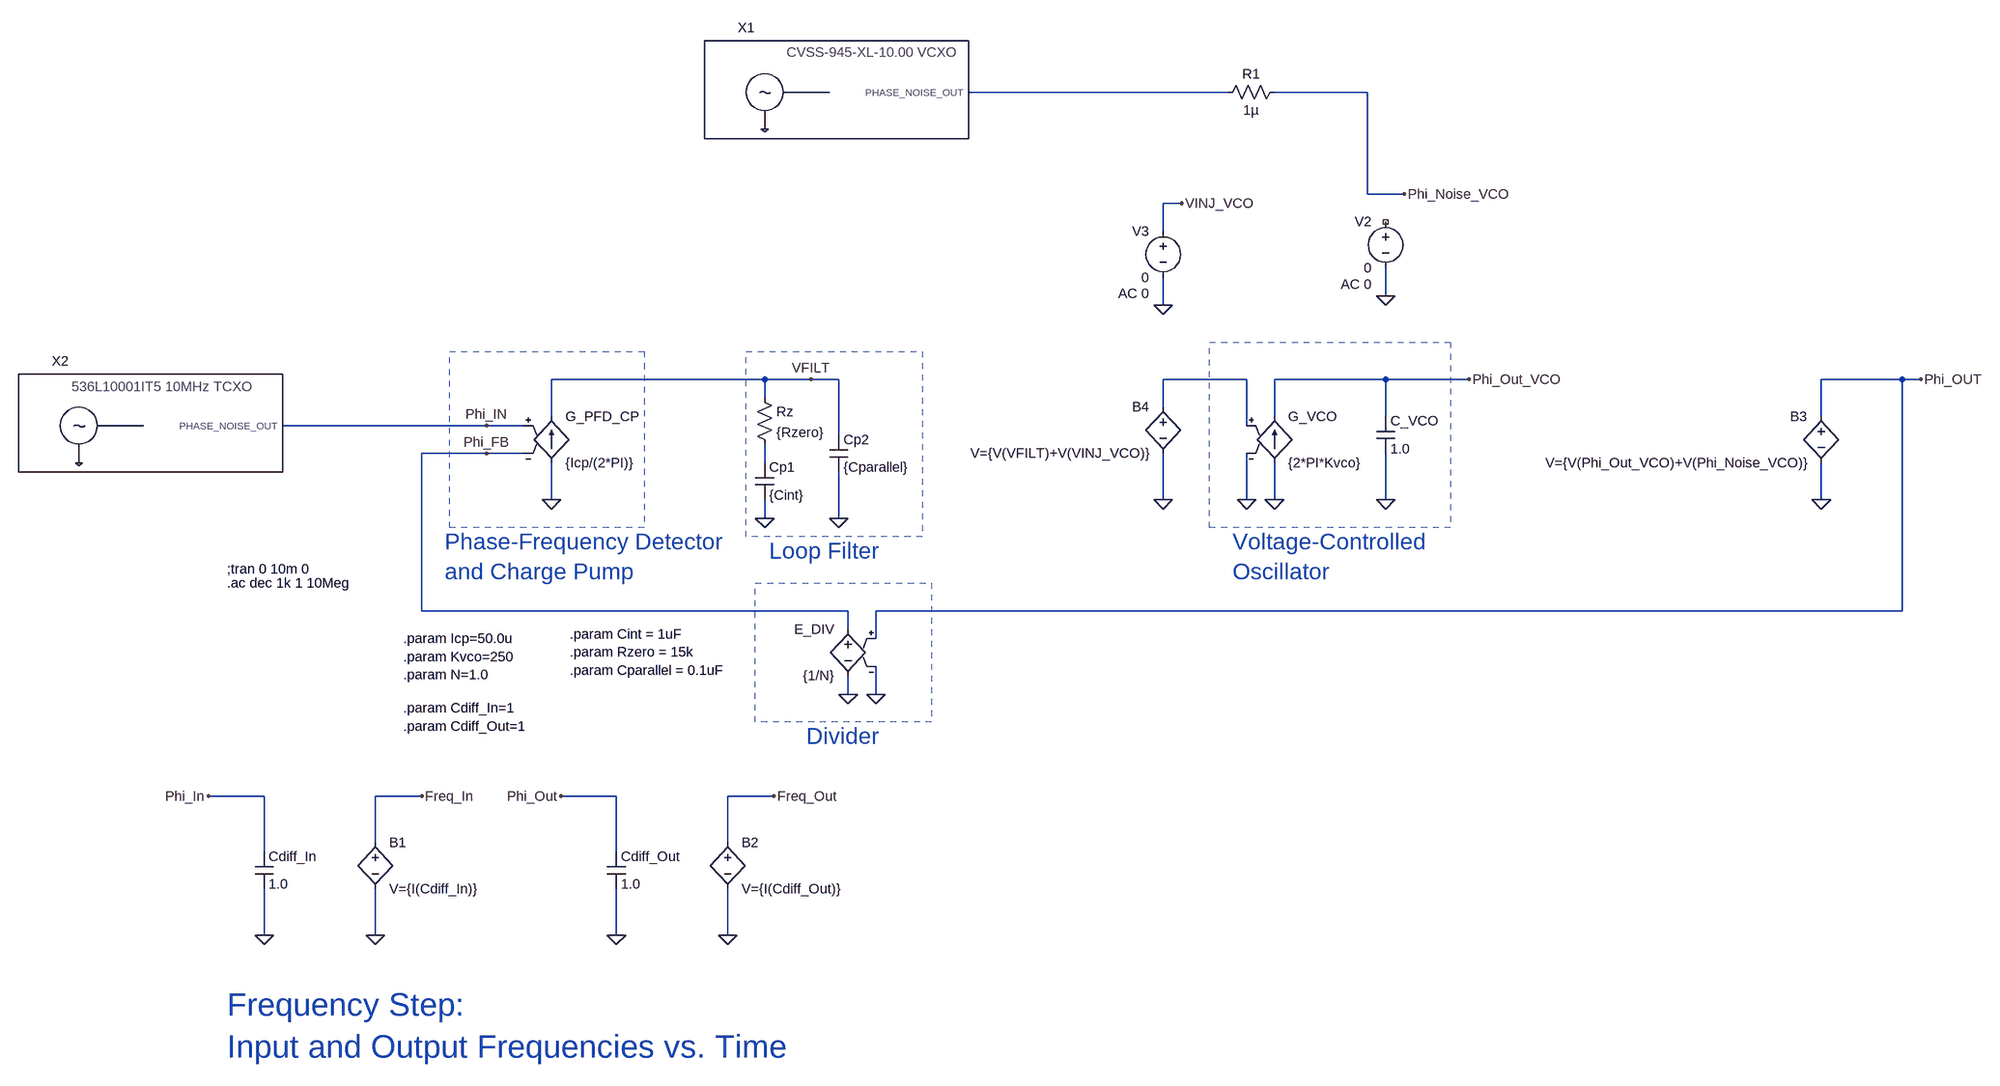
[diagram p0: schematic HMC1031_10MHz_PLL.asc]
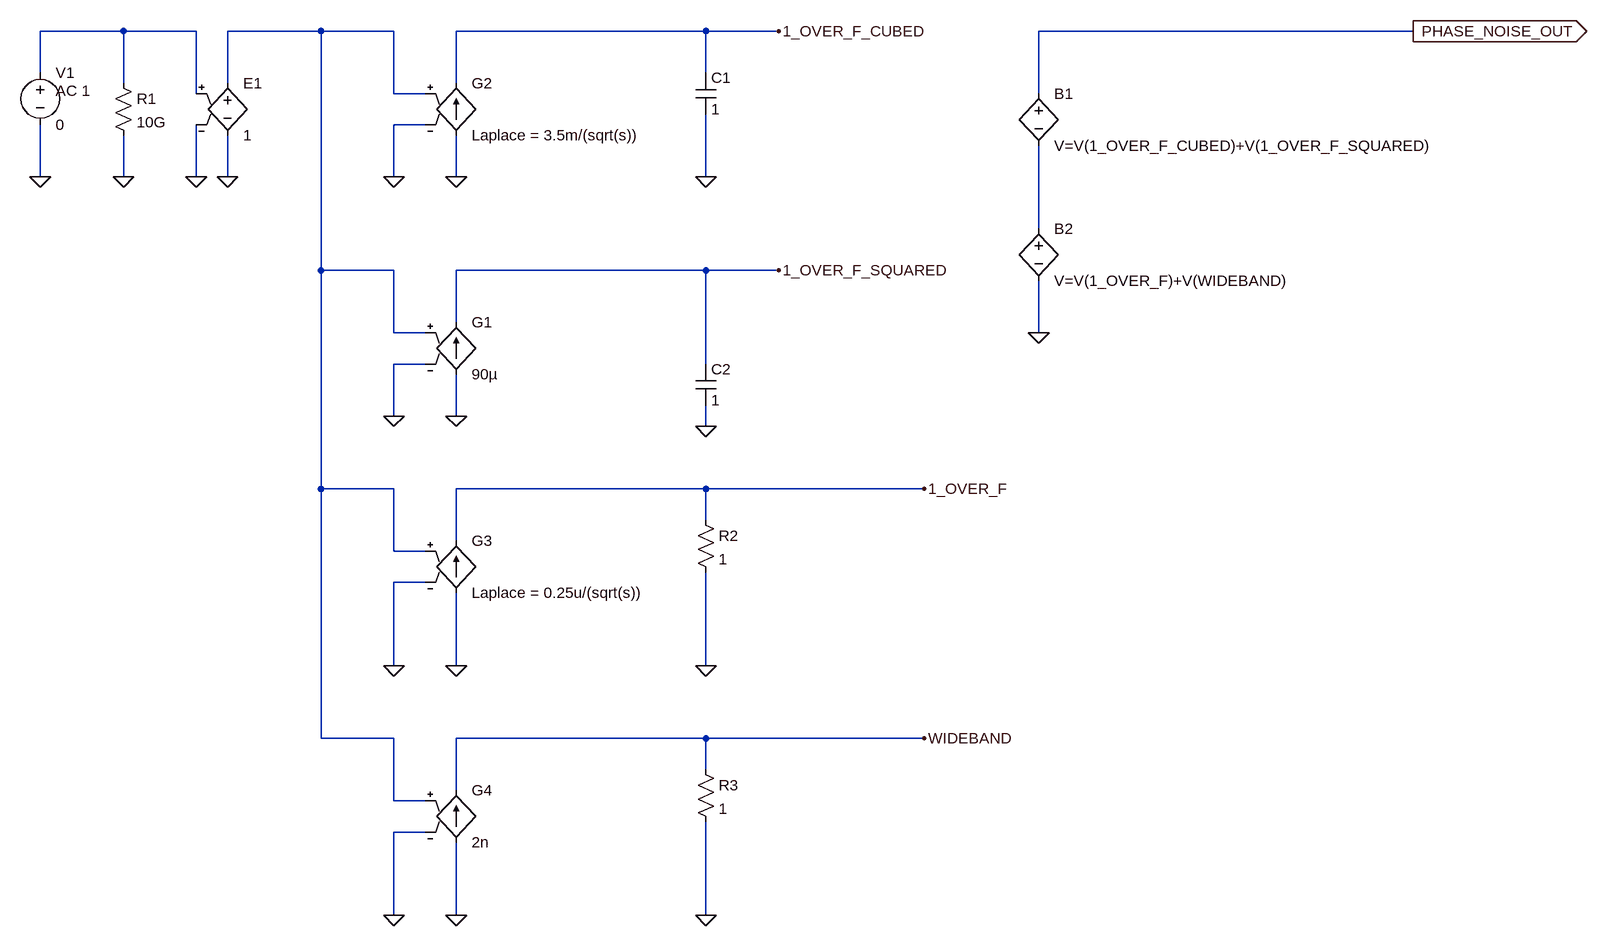
[diagram p1: sub-circuit cvss_945_xl_10_phase_noise_model.asc]
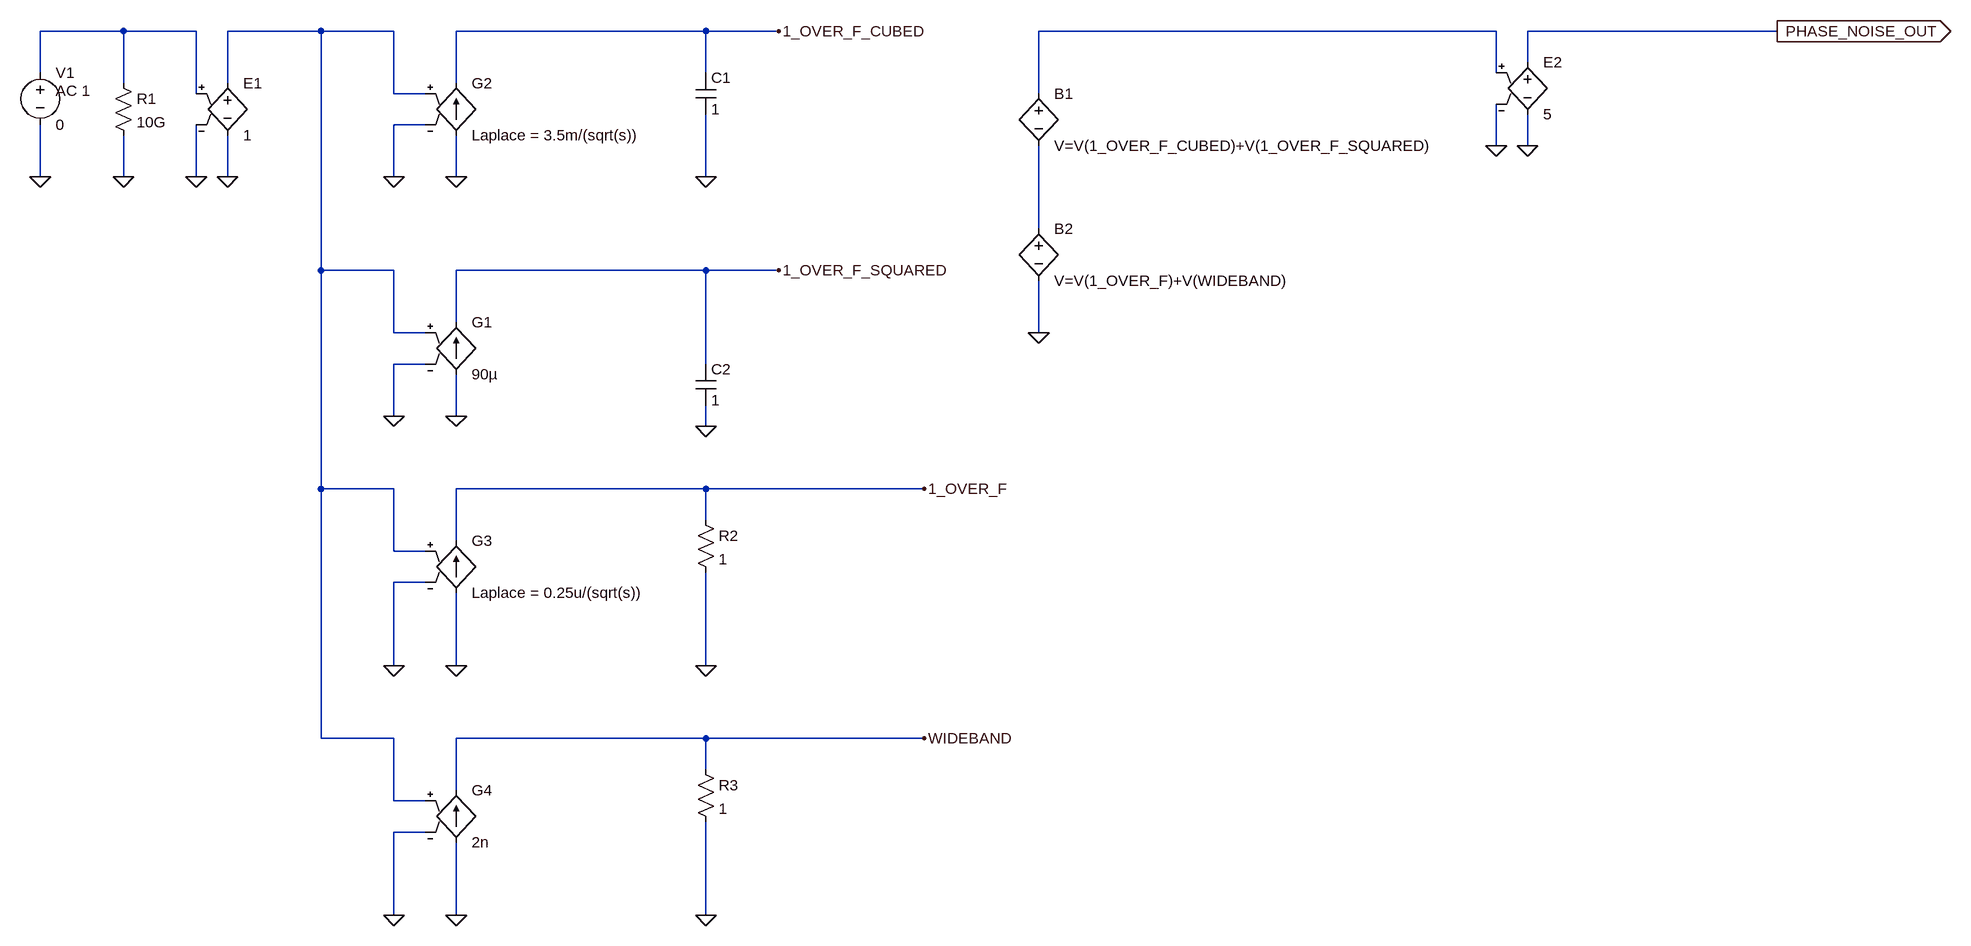
[diagram p2: sub-circuit 536l10001it5_phase_noise_model.asc]
HMC1031_10MHz_PLL.asc, the LTspice schematic file:
Version 4
SHEET 1 1592 1876
WIRE -320 -368 -768 -368
WIRE -80 -368 -240 -368
WIRE -80 -192 -80 -368
WIRE -16 -192 -80 -192
WIRE -400 -176 -432 -176
WIRE -432 -128 -432 -176
WIRE -48 -16 -48 -64
WIRE -432 0 -432 -48
WIRE -1120 128 -1488 128
WIRE -1040 128 -1120 128
WIRE -992 128 -1040 128
WIRE -288 128 -432 128
WIRE -48 128 -240 128
WIRE 96 128 -48 128
WIRE 864 128 704 128
WIRE 896 128 864 128
WIRE -1120 160 -1120 128
WIRE -432 176 -432 128
WIRE -1488 192 -1488 128
WIRE -240 192 -240 128
WIRE -48 192 -48 128
WIRE 704 192 704 128
WIRE -1600 208 -1952 208
WIRE -1536 208 -1600 208
WIRE -288 208 -288 128
WIRE -992 224 -992 128
WIRE -1600 256 -1712 256
WIRE -1536 256 -1600 256
WIRE -1120 272 -1120 240
WIRE -1488 336 -1488 272
WIRE -432 336 -432 256
WIRE -288 336 -288 256
WIRE -240 336 -240 272
WIRE -48 336 -48 256
WIRE 704 336 704 272
WIRE -1120 368 -1120 336
WIRE -992 368 -992 288
WIRE -1712 528 -1712 256
WIRE -976 528 -1712 528
WIRE 864 528 864 128
WIRE 864 528 -928 528
WIRE -976 560 -976 528
WIRE -928 576 -928 528
WIRE -976 672 -976 640
WIRE -928 672 -928 624
WIRE -1984 848 -2080 848
WIRE -1712 848 -1792 848
WIRE -1376 848 -1472 848
WIRE -1104 848 -1184 848
WIRE -1792 928 -1792 848
WIRE -1184 928 -1184 848
WIRE -1984 944 -1984 848
WIRE -1376 944 -1376 848
WIRE -1984 1088 -1984 1008
WIRE -1792 1088 -1792 1008
WIRE -1376 1088 -1376 1008
WIRE -1184 1088 -1184 1008
FLAG -992 368 0
FLAG -1488 336 0
FLAG -48 336 0
FLAG -240 336 0
FLAG -288 336 0
FLAG 896 128 Phi_OUT
FLAG -928 672 0
FLAG -976 672 0
FLAG -1600 256 Phi_FB
FLAG -1600 208 Phi_IN
FLAG -1120 368 0
FLAG -1040 128 VFILT
FLAG -1984 1088 0
FLAG -2080 848 Phi_In
FLAG -1792 1088 0
FLAG -1712 848 Freq_In
FLAG -1376 1088 0
FLAG -1472 848 Phi_Out
FLAG -1184 1088 0
FLAG -1104 848 Freq_Out
FLAG 96 128 Phi_Out_VCO
FLAG -48 -16 0
FLAG -16 -192 Phi_Noise_VCO
FLAG 704 336 0
FLAG -432 336 0
FLAG -432 0 0
FLAG -400 -176 VINJ_VCO
SYMBOL g -1488 176 R0
SYMATTR InstName G_PFD_CP
SYMATTR Value {Icp/(2*PI)}
SYMBOL cap -1008 224 R0
SYMATTR InstName Cp2
SYMATTR Value {Cparallel}
SYMBOL cap -64 192 R0
SYMATTR InstName C_VCO
SYMATTR Value 1.0
SYMBOL g -240 176 R0
SYMATTR InstName G_VCO
SYMATTR Value {2*PI*Kvco}
SYMBOL e -976 544 M0
SYMATTR InstName E_DIV
SYMATTR Value {1/N}
SYMBOL cap -1136 272 R0
SYMATTR InstName Cp1
SYMATTR Value {Cint}
SYMBOL res -1136 144 R0
SYMATTR InstName Rz
SYMATTR Value {Rzero}
SYMBOL cap -2000 944 R0
SYMATTR InstName Cdiff_In
SYMATTR Value 1.0
SYMBOL bv -1792 912 R0
SYMATTR InstName B1
SYMATTR Value V={I(Cdiff_In)}
SYMBOL cap -1392 944 R0
SYMATTR InstName Cdiff_Out
SYMATTR Value 1.0
SYMBOL bv -1184 912 R0
SYMATTR InstName B2
SYMATTR Value V={I(Cdiff_Out)}
SYMBOL voltage -48 -160 M0
WINDOW 123 24 124 Left 2
WINDOW 39 0 0 Left 2
SYMATTR Value2 AC 0
SYMATTR InstName V2
SYMATTR Value 0
SYMBOL bv 704 176 M0
SYMATTR InstName B3
SYMATTR Value V={V(Phi_Out_VCO)+V(Phi_Noise_VCO)}
SYMBOL bv -432 160 M0
SYMATTR InstName B4
SYMATTR Value V={V(VFILT)+V(VINJ_VCO)}
SYMBOL voltage -432 -144 M0
WINDOW 123 24 124 Left 2
WINDOW 39 0 0 Left 2
SYMATTR Value2 AC 0
SYMATTR InstName V3
SYMATTR Value 0
SYMBOL CVSS_945_XL_10_Phase_Noise_Model -1120 -368 R0
SYMATTR InstName X1
SYMBOL 536L10001IT5_Phase_Noise_Model -2304 208 R0
SYMATTR InstName X2
SYMBOL res -224 -384 R90
WINDOW 0 0 56 VBottom 2
WINDOW 3 32 56 VTop 2
SYMATTR InstName R1
SYMATTR Value 1µ
TEXT -1744 576 Left 2 !.param Icp=50.0u\n.param Kvco=250\n.param N=1.0
TEXT -2048 480 Left 2 !.ac dec 1k 1 10Meg
TEXT -2048 456 Left 2 !;tran 0 10m 0
TEXT -2048 1208 Left 5 ;Frequency Step:\nInput and Output Frequencies vs. Time
TEXT -1112 424 Left 4 ;Loop Filter
TEXT -1672 408 Left 4 ;Phase-Frequency Detector\nand Charge Pump
TEXT -312 408 Left 4 ;Voltage-Controlled\nOscillator
TEXT -1048 744 Left 4 ;Divider
TEXT -1456 568 Left 2 !.param Cint = 1uF\n.param Rzero = 15k\n.param Cparallel = 0.1uF
TEXT -1744 696 Left 2 !.param Cdiff_In=1\n.param Cdiff_Out=1
RECTANGLE Normal -1328 384 -1664 80 2
RECTANGLE Normal -848 400 -1152 80 2
RECTANGLE Normal 64 384 -352 64 2
RECTANGLE Normal -832 720 -1136 480 2

cvss_945_xl_10_phase_noise_model.asc, the sub-circuit schematic file:
Version 4
SHEET 1 1556 916
WIRE -720 -464 -848 -464
WIRE -608 -464 -720 -464
WIRE -416 -464 -560 -464
WIRE -304 -464 -416 -464
WIRE 176 -464 -208 -464
WIRE 288 -464 176 -464
WIRE 1264 -464 688 -464
WIRE -848 -400 -848 -464
WIRE 176 -400 176 -464
WIRE -720 -384 -720 -464
WIRE -560 -384 -560 -464
WIRE -208 -384 -208 -464
WIRE -608 -368 -608 -464
WIRE -304 -368 -304 -464
WIRE -256 -368 -304 -368
WIRE 688 -368 688 -464
WIRE -256 -320 -304 -320
WIRE -848 -240 -848 -320
WIRE -720 -240 -720 -304
WIRE -608 -240 -608 -320
WIRE -560 -240 -560 -304
WIRE -304 -240 -304 -320
WIRE -208 -240 -208 -304
WIRE 176 -240 176 -336
WIRE 688 -160 688 -288
WIRE -416 -96 -416 -464
WIRE -304 -96 -416 -96
WIRE 176 -96 -208 -96
WIRE 288 -96 176 -96
WIRE -208 -16 -208 -96
WIRE -304 0 -304 -96
WIRE -256 0 -304 0
WIRE 688 0 688 -80
WIRE -256 48 -304 48
WIRE 176 48 176 -96
WIRE -304 128 -304 48
WIRE -208 128 -208 64
WIRE 176 144 176 112
WIRE -416 240 -416 -96
WIRE -304 240 -416 240
WIRE 176 240 -208 240
WIRE 512 240 176 240
WIRE 176 288 176 240
WIRE -208 320 -208 240
WIRE -304 336 -304 240
WIRE -256 336 -304 336
WIRE -256 384 -304 384
WIRE -304 512 -304 384
WIRE -208 512 -208 400
WIRE 176 512 176 368
WIRE -416 624 -416 240
WIRE -304 624 -416 624
WIRE 176 624 -208 624
WIRE 512 624 176 624
WIRE 176 672 176 624
WIRE -208 704 -208 624
WIRE -304 720 -304 624
WIRE -256 720 -304 720
WIRE -256 768 -304 768
WIRE -304 896 -304 768
WIRE -208 896 -208 784
WIRE 176 896 176 752
FLAG -208 -240 0
FLAG -304 -240 0
FLAG 176 -240 0
FLAG 288 -464 1_OVER_F_CUBED
FLAG -560 -240 0
FLAG -608 -240 0
FLAG -720 -240 0
FLAG -208 128 0
FLAG -304 128 0
FLAG 176 144 0
FLAG 288 -96 1_OVER_F_SQUARED
FLAG -208 512 0
FLAG -304 512 0
FLAG 176 512 0
FLAG 512 240 1_OVER_F
FLAG -208 896 0
FLAG -304 896 0
FLAG 176 896 0
FLAG 512 624 WIDEBAND
FLAG 688 0 0
FLAG 1264 -464 PHASE_NOISE_OUT
IOPIN 1264 -464 Out
FLAG -848 -240 0
SYMBOL g -208 -400 R0
SYMATTR InstName G2
SYMATTR Value Laplace = 3.5m/(sqrt(s))
SYMBOL e -560 -400 R0
SYMATTR InstName E1
SYMATTR Value 1
SYMBOL res -736 -400 R0
SYMATTR InstName R1
SYMATTR Value 10G
SYMBOL cap 160 -400 R0
SYMATTR InstName C1
SYMATTR Value 1
SYMBOL g -208 -32 R0
SYMATTR InstName G1
SYMATTR Value 90µ
SYMBOL cap 160 48 R0
SYMATTR InstName C2
SYMATTR Value 1
SYMBOL g -208 304 R0
SYMATTR InstName G3
SYMATTR Value Laplace = 0.25u/(sqrt(s))
SYMBOL res 160 272 R0
SYMATTR InstName R2
SYMATTR Value 1
SYMBOL g -208 688 R0
SYMATTR InstName G4
SYMATTR Value 2n
SYMBOL res 160 656 R0
SYMATTR InstName R3
SYMATTR Value 1
SYMBOL bv 688 -384 R0
SYMATTR InstName B1
SYMATTR Value V=V(1_OVER_F_CUBED)+V(1_OVER_F_SQUARED)
SYMBOL bv 688 -176 R0
SYMATTR InstName B2
SYMATTR Value V=V(1_OVER_F)+V(WIDEBAND)
SYMBOL voltage -848 -416 R0
WINDOW 123 24 44 Left 2
WINDOW 39 0 0 Left 0
SYMATTR Value2 AC 1
SYMATTR InstName V1
SYMATTR Value 0

536l10001it5_phase_noise_model.asc, the sub-circuit schematic file:
Version 4
SHEET 1 2116 916
WIRE -720 -464 -848 -464
WIRE -608 -464 -720 -464
WIRE -416 -464 -560 -464
WIRE -304 -464 -416 -464
WIRE 176 -464 -208 -464
WIRE 288 -464 176 -464
WIRE 1392 -464 688 -464
WIRE 1824 -464 1440 -464
WIRE 1440 -416 1440 -464
WIRE -848 -400 -848 -464
WIRE 176 -400 176 -464
WIRE 1392 -400 1392 -464
WIRE -720 -384 -720 -464
WIRE -560 -384 -560 -464
WIRE -208 -384 -208 -464
WIRE -608 -368 -608 -464
WIRE -304 -368 -304 -464
WIRE -256 -368 -304 -368
WIRE 688 -368 688 -464
WIRE -256 -320 -304 -320
WIRE 1392 -288 1392 -352
WIRE 1440 -288 1440 -336
WIRE -848 -240 -848 -320
WIRE -720 -240 -720 -304
WIRE -608 -240 -608 -320
WIRE -560 -240 -560 -304
WIRE -304 -240 -304 -320
WIRE -208 -240 -208 -304
WIRE 176 -240 176 -336
WIRE 688 -160 688 -288
WIRE -416 -96 -416 -464
WIRE -304 -96 -416 -96
WIRE 176 -96 -208 -96
WIRE 288 -96 176 -96
WIRE -208 -16 -208 -96
WIRE -304 0 -304 -96
WIRE -256 0 -304 0
WIRE 688 0 688 -80
WIRE -256 48 -304 48
WIRE 176 48 176 -96
WIRE -304 128 -304 48
WIRE -208 128 -208 64
WIRE 176 144 176 112
WIRE -416 240 -416 -96
WIRE -304 240 -416 240
WIRE 176 240 -208 240
WIRE 512 240 176 240
WIRE 176 288 176 240
WIRE -208 320 -208 240
WIRE -304 336 -304 240
WIRE -256 336 -304 336
WIRE -256 384 -304 384
WIRE -304 512 -304 384
WIRE -208 512 -208 400
WIRE 176 512 176 368
WIRE -416 624 -416 240
WIRE -304 624 -416 624
WIRE 176 624 -208 624
WIRE 512 624 176 624
WIRE 176 672 176 624
WIRE -208 704 -208 624
WIRE -304 720 -304 624
WIRE -256 720 -304 720
WIRE -256 768 -304 768
WIRE -304 896 -304 768
WIRE -208 896 -208 784
WIRE 176 896 176 752
FLAG -208 -240 0
FLAG -304 -240 0
FLAG 176 -240 0
FLAG 288 -464 1_OVER_F_CUBED
FLAG -560 -240 0
FLAG -608 -240 0
FLAG -720 -240 0
FLAG -208 128 0
FLAG -304 128 0
FLAG 176 144 0
FLAG 288 -96 1_OVER_F_SQUARED
FLAG -208 512 0
FLAG -304 512 0
FLAG 176 512 0
FLAG 512 240 1_OVER_F
FLAG -208 896 0
FLAG -304 896 0
FLAG 176 896 0
FLAG 512 624 WIDEBAND
FLAG 688 0 0
FLAG 1824 -464 PHASE_NOISE_OUT
IOPIN 1824 -464 Out
FLAG -848 -240 0
FLAG 1392 -288 0
FLAG 1440 -288 0
SYMBOL g -208 -400 R0
SYMATTR InstName G2
SYMATTR Value Laplace = 3.5m/(sqrt(s))
SYMBOL e -560 -400 R0
SYMATTR InstName E1
SYMATTR Value 1
SYMBOL res -736 -400 R0
SYMATTR InstName R1
SYMATTR Value 10G
SYMBOL cap 160 -400 R0
SYMATTR InstName C1
SYMATTR Value 1
SYMBOL g -208 -32 R0
SYMATTR InstName G1
SYMATTR Value 90µ
SYMBOL cap 160 48 R0
SYMATTR InstName C2
SYMATTR Value 1
SYMBOL g -208 304 R0
SYMATTR InstName G3
SYMATTR Value Laplace = 0.25u/(sqrt(s))
SYMBOL res 160 272 R0
SYMATTR InstName R2
SYMATTR Value 1
SYMBOL g -208 688 R0
SYMATTR InstName G4
SYMATTR Value 2n
SYMBOL res 160 656 R0
SYMATTR InstName R3
SYMATTR Value 1
SYMBOL bv 688 -384 R0
SYMATTR InstName B1
SYMATTR Value V=V(1_OVER_F_CUBED)+V(1_OVER_F_SQUARED)
SYMBOL bv 688 -176 R0
SYMATTR InstName B2
SYMATTR Value V=V(1_OVER_F)+V(WIDEBAND)
SYMBOL voltage -848 -416 R0
WINDOW 123 24 44 Left 2
WINDOW 39 0 0 Left 0
SYMATTR Value2 AC 1
SYMATTR InstName V1
SYMATTR Value 0
SYMBOL e 1440 -432 R0
SYMATTR InstName E2
SYMATTR Value 5

The netlist it stands for:
* HMC1031_10MHz_PLL.asc
G_PFD_CP 0 VFILT Phi_IN Phi_FB {Icp/(2*PI)}
Cp2 VFILT 0 {Cparallel}
C_VCO Phi_Out_VCO 0 1.0
G_VCO 0 Phi_Out_VCO N002 0 {2*PI*Kvco}
E_DIV Phi_FB 0 Phi_OUT 0 {1/N}
Cp1 N003 0 {Cint}
Rz VFILT N003 {Rzero}
Cdiff_In Phi_IN 0 1.0
B1 Freq_In 0 V={I(Cdiff_In)}
Cdiff_Out Phi_OUT 0 1.0
B2 Freq_Out 0 V={I(Cdiff_Out)}
V2 NC_01 0 0 AC 0
B3 Phi_OUT 0 V={V(Phi_Out_VCO)+V(Phi_Noise_VCO)}
B4 N002 0 V={V(VFILT)+V(VINJ_VCO)}
V3 VINJ_VCO 0 0 AC 0
XX1 N001 cvss_945_xl_10_phase_noise_model
XX2 Phi_IN 536l10001it5_phase_noise_model
R1 Phi_Noise_VCO N001 1µ

* block symbol definitions
.subckt cvss_945_xl_10_phase_noise_model PHASE_NOISE_OUT
G2 0 1_OVER_F_CUBED N002 0 Laplace = 3.5m/(sqrt(s))
E1 N002 0 N001 0 1
R1 N001 0 10G
C1 1_OVER_F_CUBED 0 1
G1 0 1_OVER_F_SQUARED N002 0 90µ
C2 1_OVER_F_SQUARED 0 1
G3 0 1_OVER_F N002 0 Laplace = 0.25u/(sqrt(s))
R2 1_OVER_F 0 1
G4 0 WIDEBAND N002 0 2n
R3 WIDEBAND 0 1
B1 PHASE_NOISE_OUT N003 V=V(1_OVER_F_CUBED)+V(1_OVER_F_SQUARED)
B2 N003 0 V=V(1_OVER_F)+V(WIDEBAND)
V1 N001 0 0 AC 1
.ends cvss_945_xl_10_phase_noise_model

.subckt 536l10001it5_phase_noise_model PHASE_NOISE_OUT
G2 0 1_OVER_F_CUBED N002 0 Laplace = 3.5m/(sqrt(s))
E1 N002 0 N001 0 1
R1 N001 0 10G
C1 1_OVER_F_CUBED 0 1
G1 0 1_OVER_F_SQUARED N002 0 90µ
C2 1_OVER_F_SQUARED 0 1
G3 0 1_OVER_F N002 0 Laplace = 0.25u/(sqrt(s))
R2 1_OVER_F 0 1
G4 0 WIDEBAND N002 0 2n
R3 WIDEBAND 0 1
B1 N003 N004 V=V(1_OVER_F_CUBED)+V(1_OVER_F_SQUARED)
B2 N004 0 V=V(1_OVER_F)+V(WIDEBAND)
V1 N001 0 0 AC 1
E2 PHASE_NOISE_OUT 0 N003 0 5
.ends 536l10001it5_phase_noise_model

.param Icp=50.0u
.param Kvco=250
.param N=1.0
.ac dec 1k 1 10Meg
;tran 0 10m 0
* Frequency Step:
* Input and Output Frequencies vs. Time
* Loop Filter
* Phase-Frequency Detector
* and Charge Pump
* Voltage-Controlled
* Oscillator
* Divider
.param Cint = 1uF
.param Rzero = 15k
.param Cparallel = 0.1uF
.param Cdiff_In=1
.param Cdiff_Out=1
.backanno
.end

* Results of the author's LTspice run, read from the files saved beside the schematic
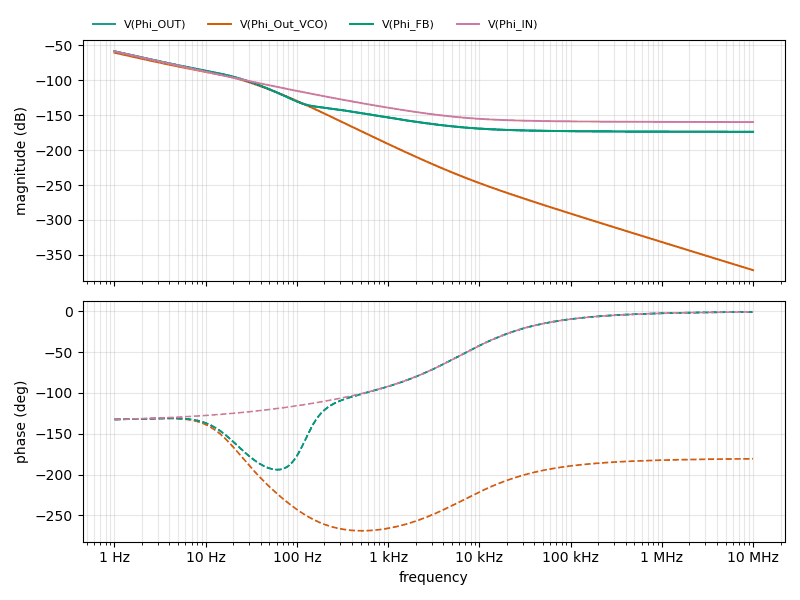
[diagram p3: AC Analysis of HMC1031_10MHz_PLL.asc, plotted from the saved traces]
* AC Analysis, 1 run:
*   V(Phi_OUT): -58.67 dB at 1 Hz, -173.88 dB at 10 MHz, peak -58.67 dB at 1 Hz, 3 dB below the peak at 1.266 Hz
*   V(Phi_Out_VCO): -60.60 dB at 1 Hz, -371.83 dB at 10 MHz, peak -60.60 dB at 1 Hz, 3 dB below the peak at 1.266 Hz
*   V(Phi_FB): -58.67 dB at 1 Hz, -173.88 dB at 10 MHz, peak -58.67 dB at 1 Hz, 3 dB below the peak at 1.266 Hz
*   V(Phi_IN): -58.69 dB at 1 Hz, -159.90 dB at 10 MHz, peak -58.69 dB at 1 Hz, 3 dB below the peak at 1.265 Hz